# EAGLE design ECE445_Interrogator_Schematic_FINAL (EAGLE 7.5.0)
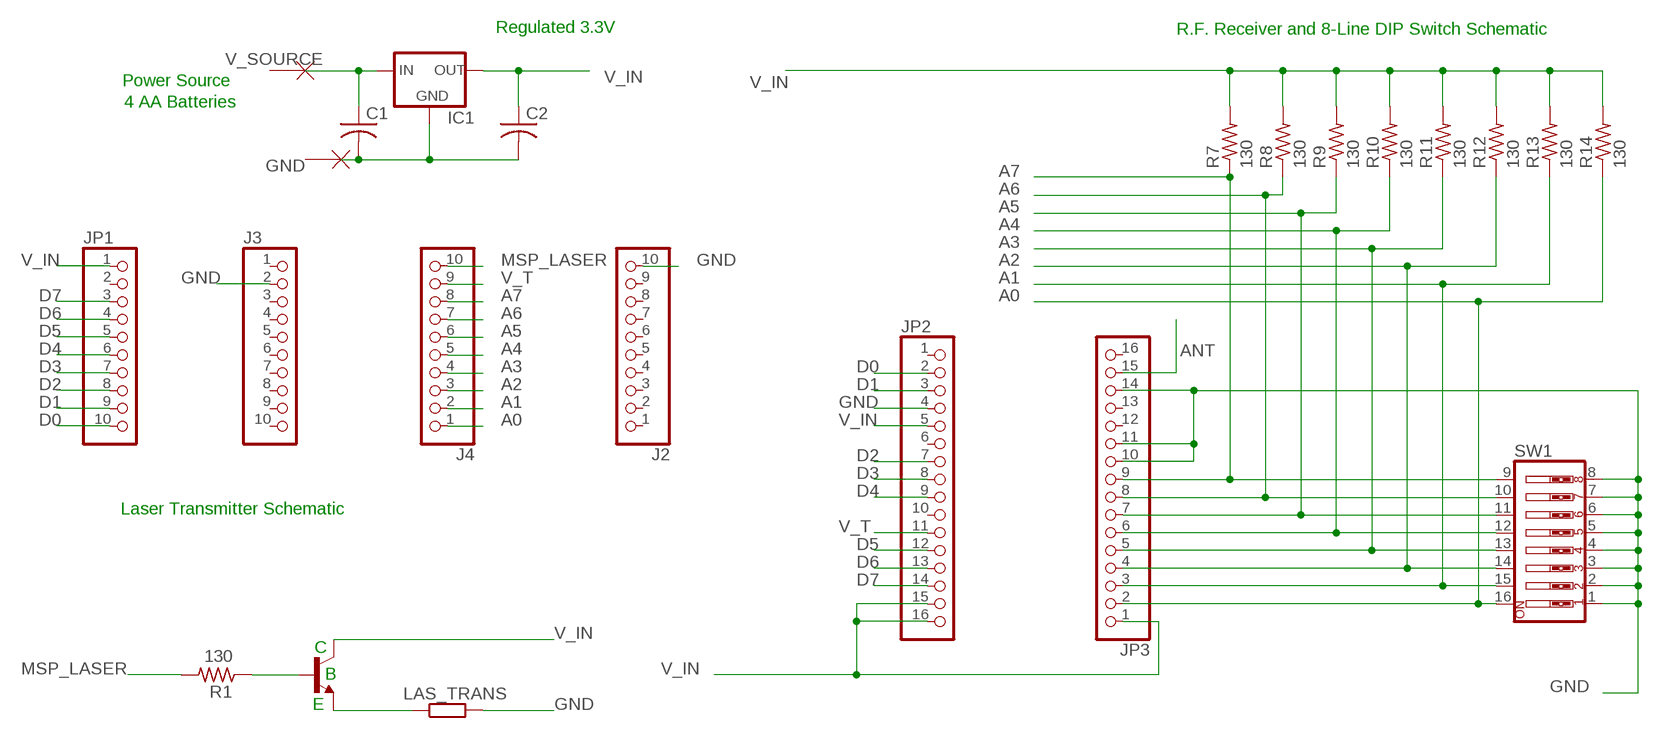
[diagram p0: schematic, sheet 1]

## Parts
C1  C-US050-025X075  [C050-025X075]
C2  C-US050-025X075  [C050-025X075]
IC1  78LXX  [78LXX]
J2  PINHD-1X10  [1X10]
J3  PINHD-1X10  [1X10]
J4  PINHD-1X10  [1X10]
JP1  PINHD-1X10  [1X10]
JP2  PINHD-1X16  [1X16]
JP3  PINHD-1X16  [1X16]
LAS_TRANS  R-EU_0204/5  [0204/5]
Q2  BC338  [TO92-EBC]
R1  130  R-US_0204/5  [0204/5]
R7  130  R-US_0204/5  [0204/5]
R8  130  R-US_0204/5  [0204/5]
R9  130  R-US_0204/5  [0204/5]
R10  130  R-US_0204/5  [0204/5]
R11  130  R-US_0204/5  [0204/5]
R12  130  R-US_0204/5  [0204/5]
R13  130  R-US_0204/5  [0204/5]
R14  130  R-US_0204/5  [0204/5]
SW1  SW_DIP-8  [EDG-08]
U$1  NO_CONNECT  [NO_CONNECT]
U$2  NO_CONNECT  [NO_CONNECT]

## Nets
A0: J4.1 JP3.2 R14.1 SW1.16
A1: J4.2 JP3.3 R13.1 SW1.15
A2: J4.3 JP3.4 R12.1 SW1.14
A3: J4.4 JP3.5 R11.1 SW1.13
A4: J4.5 JP3.6 R10.1 SW1.12
A5: J4.6 JP3.7 R9.1 SW1.11
A6: J4.7 JP3.8 R8.1 SW1.10
A7: J4.8 JP3.9 R7.1 SW1.9
ANT: JP3.15
D0: JP1.10 JP2.2
D1: JP1.9 JP2.3
D2: JP1.8 JP2.7
D3: JP1.7 JP2.8
D4: JP1.6 JP2.9
D5: JP1.5 JP2.12
D6: JP1.4 JP2.13
D7: JP1.3 JP2.14
GND: C1.2 C2.2 IC1.GND J2.10 J3.2 JP2.4 JP3.10 JP3.11 JP3.14 LAS_TRANS.2 SW1.1 SW1.2 SW1.3 SW1.4 SW1.5 SW1.6 SW1.7 SW1.8 U$1.P$1(NC)
MSP_LASER: J4.10 R1.2
N$1: LAS_TRANS.1 Q2.E
N$7: Q2.B R1.1
V_IN: C2.1 IC1.OUT JP1.1 JP2.5 JP2.15 JP2.16 JP3.1 Q2.C R7.2 R8.2 R9.2 R10.2 R11.2 R12.2 R13.2 R14.2
V_SOURCE: C1.1 IC1.IN U$2.P$1(NC)
V_T: J4.9 JP2.11
Unconnected: J2.1 J2.2 J2.3 J2.4 J2.5 J2.6 J2.7 J2.8 J2.9 J3.1 J3.3 J3.4 J3.5 J3.6 J3.7 J3.8 J3.9 J3.10 JP1.2 JP2.1 JP2.6 JP2.10 JP3.12 JP3.13 JP3.16

## Notes on the sheet
- Regulated 3.3V | R.F. Receiver and 8-Line DIP Switch Schematic
- Power Source
- 4 AA Batteries
- Laser Transmitter Schematic
- C
- B
- E

## Library data of the parts
C1 C2 = rcl:C-US: CAPACITOR, American symbol
IC1 = MarkSmartsPartsSpring2015:78LXX: VOLTAGE REGULATOR
J2-J4 JP1 = pinhead:PINHD-1X10: PIN HEADER
JP2 JP3 = pinhead:PINHD-1X16: PIN HEADER
LAS_TRANS = rcl:R-EU_: RESISTOR, European symbol
Q2 = MarkSmartsPartsSpring2015:BC338*: NPN Transistor
R1 R7-R14 = rcl:R-US_: RESISTOR, American symbol
SW1 = special:SW_DIP-8: DIP SWITCH
U$1 U$2 = NO_CONNECT:NO_CONNECT

## Board
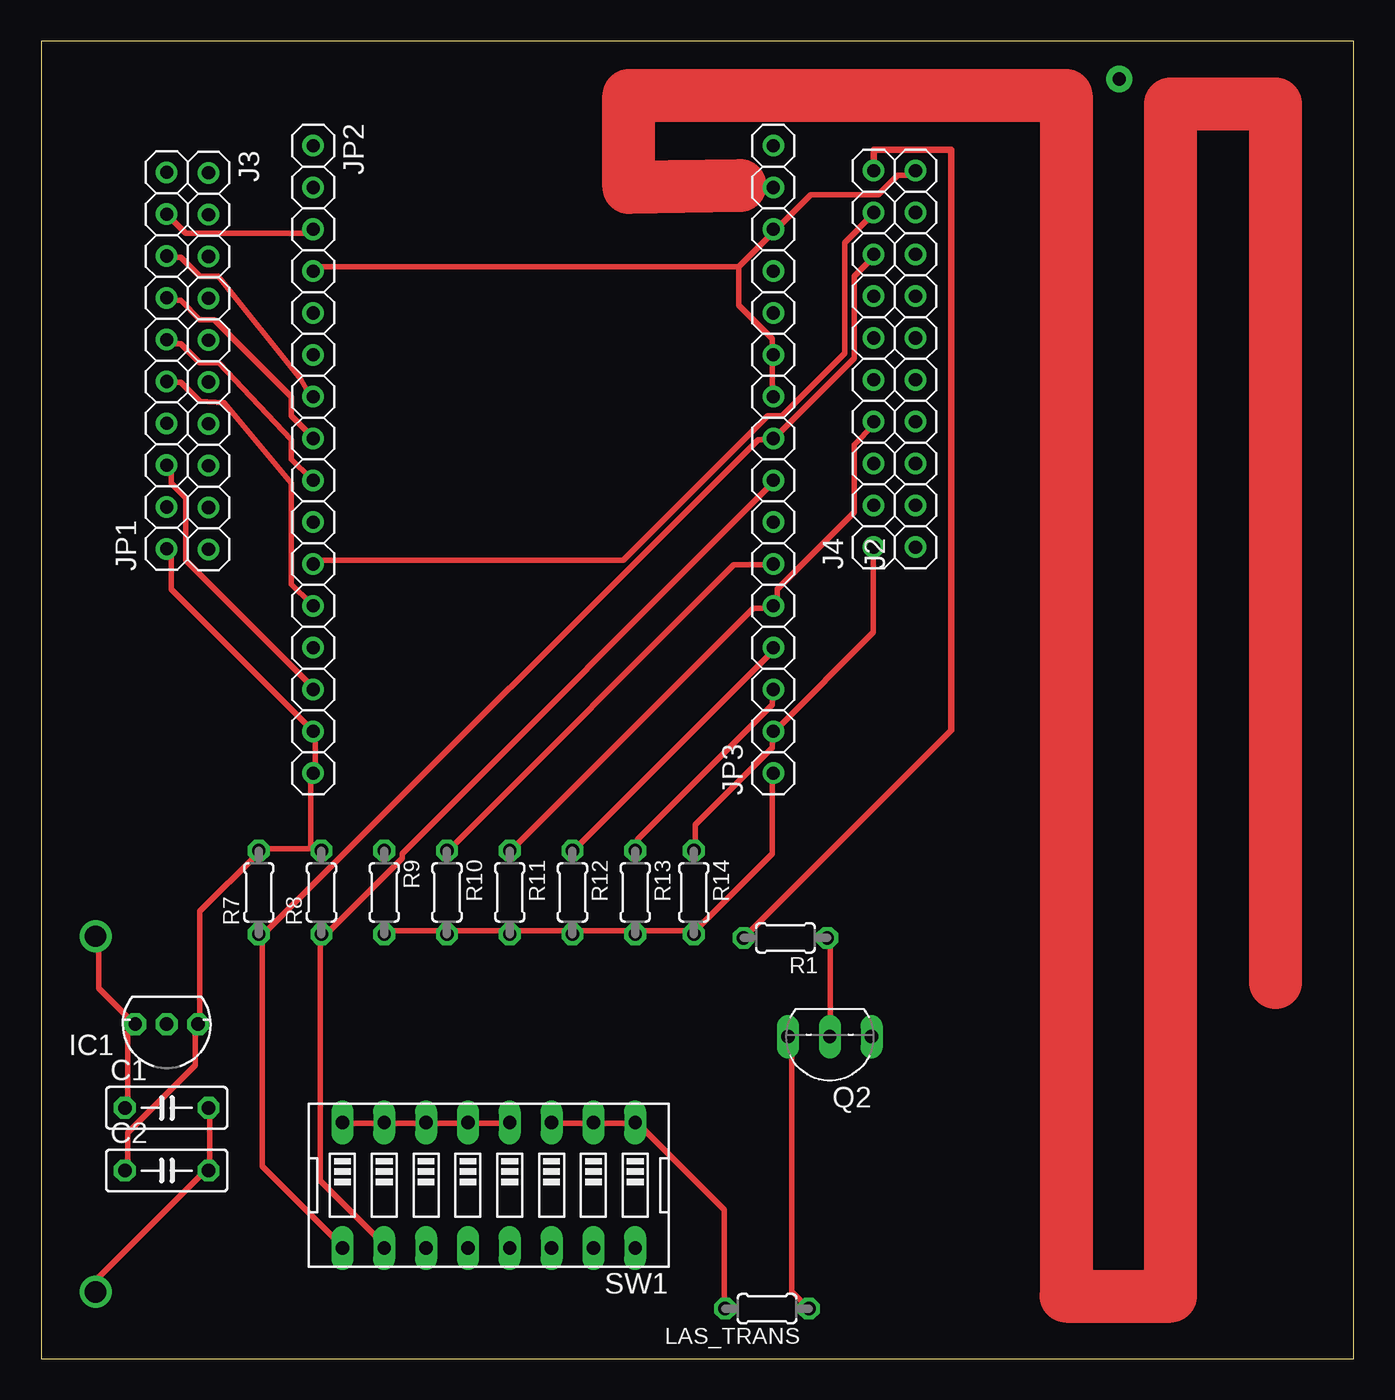
[diagram p1: board, top side]
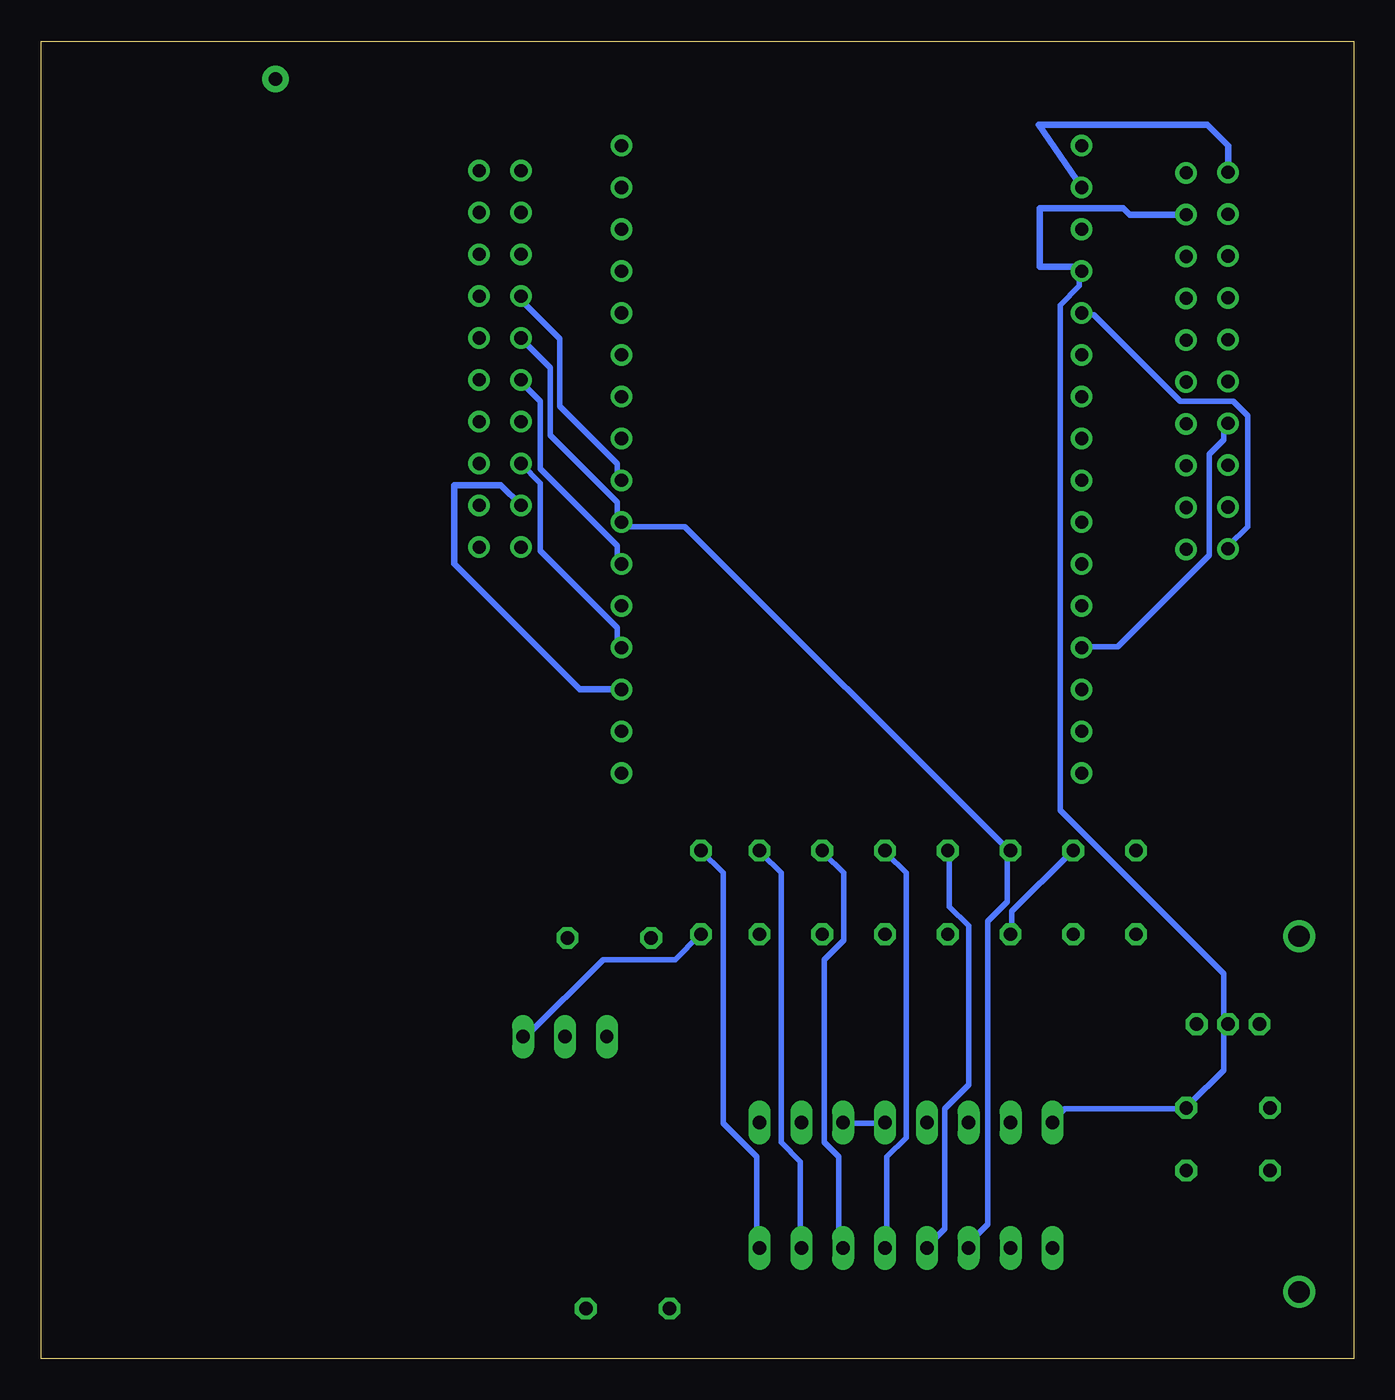
[diagram p2: board, bottom side, seen from below]

Size 79.68 x 80 mm. Coordinates in mm from the lower left corner, seen from the top.
Outline: 0,0 79.68,0 79.68,80 0,80 0,0
Copper layers (1*16): Top 0.035mm / dielectric 1.5mm / Bottom 0.035mm
Design rules "MWSEagleDesignRules2 *": minimum track width 13mil, minimum drill 22mil, track to track 10mil, track to pad 10mil, pad to pad 10mil, via to via 10mil, smd to smd 8mil, copper to edge 40mil, drill to drill 8mil, minimum pad ring 10mil, minimum via ring 8mil, stop-mask expansion 4mil, vias tented up to drill 0mil, thermal gap 10mil

### Footprints (pad centres in the part's own frame; a part is rotated, then mirrored left to right if it is on the bottom)
C050-025X075 = drill 0.813 octagon: 1 -2.54,0; 2 2.54,0
78LXX = drill 0.813 octagon: GND 0,0; IN 1.905,0; OUT -1.905,0
1X10 = drill 0.8: 1 -11.43,0; 2 -8.89,0; 3 -6.35,0; 4 -3.81,0; 5 -1.27,0; 6 1.27,0; 7 3.81,0; 8 6.35,0; 9 8.89,0; 10 11.43,0; 11 -8.89,0
1X16 = drill 0.8: 1 -19.05,0; 2 -16.51,0; 3 -13.97,0; 4 -11.43,0; 5 -8.89,0; 6 -6.35,0; 7 -3.81,0; 8 -1.27,0; 9 1.27,0; 10 3.81,0; 11 6.35,0; 12 8.89,0; 13 11.43,0; 14 13.97,0; 15 16.51,0; 16 19.05,0
0204/5 = drill 0.813 octagon: 1 -2.54,0; 2 2.54,0
TO92-EBC = drill 0.813 long: B 0,-1.27; C -2.54,-1.27; E 2.54,-1.27
EDG-08 = drill 0.813 long: 1 -8.89,-3.81; 2 -6.35,-3.81; 3 -3.81,-3.81; 4 -1.27,-3.81; 5 1.27,-3.81; 6 3.81,-3.81; 7 6.35,-3.81; 8 8.89,-3.81; 9 8.89,3.81; 10 6.35,3.81; 11 3.81,3.81; 12 1.27,3.81; 13 -1.27,3.81; 14 -3.81,3.81; 15 -6.35,3.81; 16 -8.89,3.81
NO_CONNECT = drill 1.3: P$1 0,0

### Placement (x,y rotation side)
C1  7.62,15.24 0 top
C2  7.62,11.43 0 top
IC1  7.62,20.32 180 top
J2  53.09,60.71 90 top
J3  10.16,60.58 270 top
J4  50.55,60.71 90 top
JP1  7.62,60.6 90 top
JP2  16.51,54.61 270 top
JP3  44.45,54.61 90 top
LAS_TRANS  44.07,3.05 180 top
Q2  47.88,18.29 180 top
R1  45.19,25.55 180 top
R7  13.21,28.32 90 top
R8  17.02,28.32 90 top
R9  20.83,28.32 270 top
R10  24.64,28.32 270 top
R11  28.45,28.32 270 top
R12  32.26,28.32 270 top
R13  36.07,28.32 270 top
R14  39.62,28.32 270 top
SW1  27.18,10.54 180 top
U$1  3.3,4.06 0 top
U$2  3.3,25.65 0 top

### Tracks (layer width: path | path; a pad name or v marks a point on that pad's centre or on a via)
A0
  Top 0.33: R14.1 39.73,30.96 39.73,32.42 44.4,37.1 44.4,37.97 JP3.2 44.69,38.27 50.53,44.11 50.53,49.07 J4.1
  Bottom 0.33: R14.1 38.27,29.5 38.27,14.31 36.22,12.27 36.22,7.01 SW1.16
A1
  Top 0.33: JP3.3 44.4,40.6 44.4,39.73 36.22,31.55 36.22,30.96 R13.1
  Bottom 0.33: SW1.15 33.59,7.01 33.59,11.98 34.76,13.14 34.76,29.5 35.93,30.67 R13.1
  Bottom 0.406: JP3.3 46.99,40.64 54.61,48.26 54.61,53.03 51.77,53.03 J4.2
A2
  Top 0.33: JP3.4 44.4,42.94 32.42,30.96 R12.1
  Bottom 0.33: JP3.4 44.69,43.23 44.69,44.4 49.37,49.07 49.37,53.16 50.53,54.33 J4.3 | SW1.14 31.25,7.01 31.25,12.27 32.13,13.14 32.13,24.24 30.96,25.41 30.96,29.5 32.13,30.67 R12.1
A3
  Top 0.33: J4.4 50.53,56.67 49.37,55.5 49.37,51.41 44.69,46.74 44.69,45.86 JP3.5 44.4,45.57 43.23,45.57 28.63,30.96 R11.1
  Bottom 0.33: SW1.13 28.33,7.01 28.33,12.27 27.16,13.44 27.16,29.5 28.33,30.67 R11.1
A4
  Top 0.33: JP3.6 44.4,48.2 42.06,48.2 24.83,30.96 R10.1
  Bottom 0.33: JP3.6 44.69,48.49 44.69,49.37 49.37,54.04 49.37,58.13 50.53,59.3 J4.5 | R10.1 24.54,30.67 24.54,27.46 23.37,26.29 23.37,16.65 24.83,15.19 24.83,7.89 25.7,7.01 SW1.12
A5
  Bottom 0.33: J4.6 50.53,61.92 48.78,60.17 48.78,56.08 44.69,51.99 44.69,50.83 JP3.7 44.4,50.53 40.6,50.53 21.03,30.96 R9.1 21.03,30.67 21.03,27.75 22.2,26.58 22.2,8.18 23.37,7.01 SW1.11
A6
  Top 0.33: SW1.10 20.74,7.01 16.94,10.81 16.94,25.7 R8.1 17.23,25.7 21.91,30.38 21.91,30.67 44.4,53.16 JP3.8
  Bottom 0.33: JP3.8 44.69,53.45 44.69,54.33 48.2,57.84 48.2,61.92 50.53,64.26 J4.7
A7
  Top 0.33: J4.8 50.53,66.89 49.37,65.72 49.37,60.76 44.69,56.08 JP3.9 44.4,55.79 43.52,55.79 13.44,25.7 | 13.44,25.7 13.44,11.68 18.11,7.01 SW1.9 | 13.44,25.7 R7.1
D0
  Bottom 0.406: JP1.10 7.62,73.66 8.89,74.93 19.13,74.93 JP2.2
D1
  Top 0.33: JP1.9 8.76,68.35 16.36,68.35 JP2.3
D2
  Top 0.33: JP1.8 7.89,66.89 8.47,66.89 9.64,65.72 10.76,65.72 15.75,59.49 16.36,58.42 JP2.7
D3
  Top 0.33: JP1.7 7.89,64.26 8.47,64.26 9.64,63.09 10.52,63.09 15.19,58.42 15.19,57.25 16.36,56.08 JP2.8
D4
  Top 0.33: JP1.6 7.89,61.63 8.47,61.63 9.64,60.47 10.77,60.47 15.19,55.79 15.19,54.62 16.36,53.45 JP2.9
D5
  Top 0.33: JP1.5 7.89,59.3 8.47,59.3 9.64,58.13 11.11,58.05 15.19,53.16 15.19,47.03 16.36,45.86 JP2.12
D6
  Bottom 0.33: JP1.4 7.89,56.67 7.89,55.79 8.76,54.91 8.76,48.78 14.31,43.23 16.36,43.23 JP2.13
D7
  Top 0.33: JP1.3 7.89,54.04 7.89,53.16 8.76,52.29 8.76,48.49 16.36,40.89 JP2.14
GND
  Top 0.33: JP3.10 44.4,58.42 44.4,60.76 JP3.11 44.4,61.05 44.4,61.92 42.35,63.97 42.35,66.31 | 42.35,66.31 16.65,66.31 JP2.4 | 42.35,66.31 44.4,68.35 JP3.14 44.69,68.64 46.74,70.69 50.83,70.69 51.99,71.86 52.87,71.86 J2.10 | C1.2 10.22,15.19 10.22,11.68 C2.2 9.93,11.39 3.5,4.97 3.5,4.09 U$1.P$1 | SW1.8 18.4,14.31 20.74,14.31 SW1.7 21.03,14.31 23.37,14.31 | SW1.4 28.33,14.31 26,14.31 SW1.5 25.7,14.31 23.37,14.31 | SW1.3 31.25,14.31 33.3,14.31 SW1.2 33.59,14.31 35.93,14.31 SW1.1 36.22,14.31 41.48,9.05 41.48,3.21 LAS_TRANS.2 | 23.37,14.31 SW1.6
  Bottom 0.33: 30.81,14.33 SW1.3 30.67,14.31 28.63,14.31 SW1.4 28.47,14.33 | SW1.8 18.11,14.61 17.53,15.19 10.22,15.19 C1.2 9.93,15.48 7.89,17.53 7.89,20.16 IC1.GND 7.89,20.45 7.89,23.37 17.82,33.3 17.82,63.97 16.65,65.14 16.65,66.02 JP2.4
  Bottom 0.406: J3.2 13.59,69.47 13.97,69.85 19.05,69.85 19.05,66.31 16.78,66.31 JP2.4
MSP_LASER
  Top 0.406: J4.10 50.55,73.41 55.24,73.41 55.24,38.15 R1.2
N$1
  Top 0.33: LAS_TRANS.1 45.57,4.09 45.57,19.28 Q2.E
N$3
  Top 3.226: 35.69,71.12 42.44,71.25
N$4
  Top 3.226: 40.51,71.2 35.69,71.12 35.69,76.71 62.23,76.71 62.23,3.81 68.58,3.81 68.58,76.2 74.93,76.2
N$5
  Top 3.23: 74.93,76.2 74.93,22.86
N$6  (via drill 0.8)
  other vias: 65.46,77.7
N$7
  Top 0.33: R1.1 47.9,25.41 47.9,19.57 Q2.B
V_IN
  Top 0.33: 32.27,25.72 R12.2 | 36.07,25.72 R13.2 | R9.2 21.03,26 24.54,26 R10.2 24.83,26 28.33,26 R11.2 28.63,26 32.13,26 R12.2 | JP3.1 44.4,35.34 44.4,30.67 39.73,26 R14.2 39.43,26 36.22,26 R13.2 | R12.2 32.42,26 35.93,26 R13.2 | C2.1 5.26,11.68 5.26,13.73 9.35,17.82 9.35,20.16 IC1.OUT 9.64,20.45 9.64,27.16 13.14,30.67 R7.2 13.44,30.96 16.36,30.96 | 16.36,30.96 16.94,30.96 R8.2 | JP1.1 7.89,49.07 7.89,46.74 16.36,38.27 JP2.15 16.65,37.97 16.65,35.64 JP2.16 16.36,35.34 16.36,30.96
  Bottom 0.33: Q2.C 50.24,19.57 45.57,24.24 41.19,24.24 39.73,25.7 R14.2 | JP2.5 16.36,63.39 15.77,63.39 10.52,58.13 7.3,58.13 6.43,57.25 6.43,50.53 7.59,49.37 JP1.1 | R9.2 20.74,26 20.74,27.16 17.23,30.67 R8.2
V_SOURCE
  Top 0.33: C1.1 5.26,15.48 5.26,19.86 IC1.IN 5.55,20.45 3.5,22.49 3.5,25.41 U$2.P$1
V_T
  Top 0.33: JP2.11 16.65,48.49 35.34,48.49 44.11,57.25 44.98,57.25 48.78,61.05 48.78,67.77 50.53,69.52 J4.9